# Altium schematic sheet MCU_Unit.SchDoc
size A4
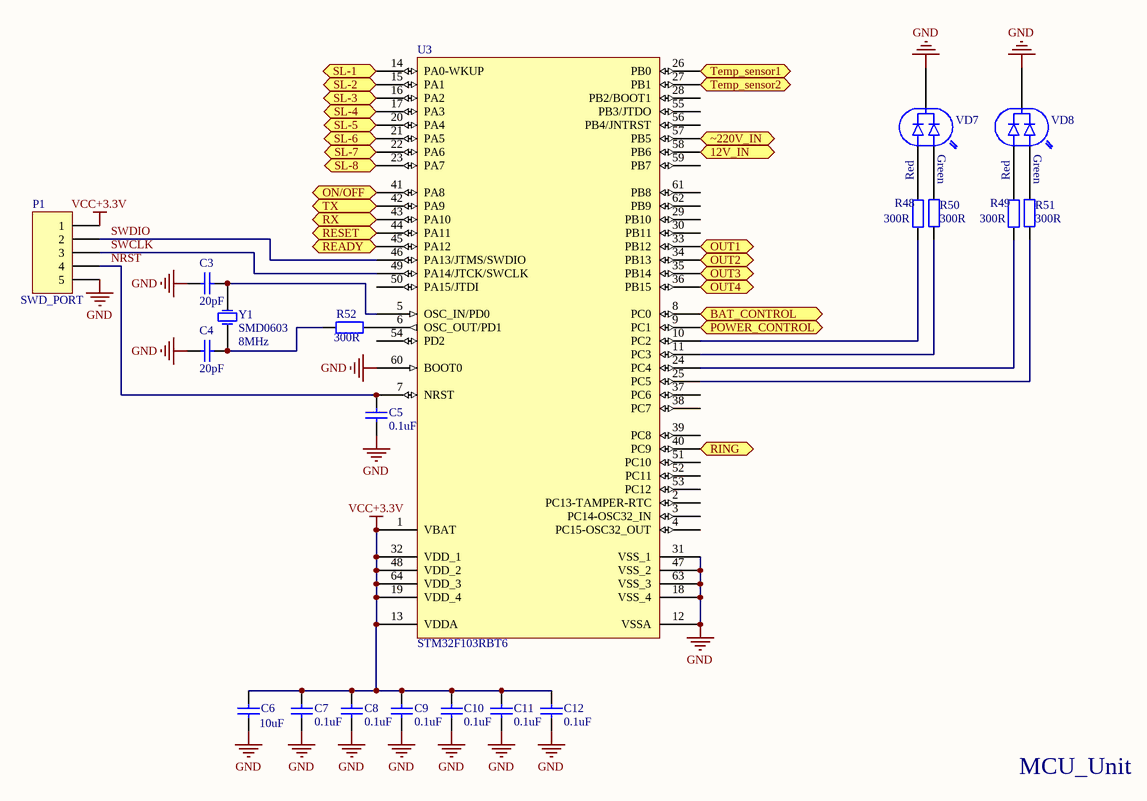
[diagram p0: MCU_Unit.SchDoc]

## Parts
C3  value 20pF  [C0603]  (hidden comment: CAP_SMD)
C4  value 20pF  [C0603]  (hidden comment: CAP_SMD)
C5  value 0.1uF  [C0603]  (hidden comment: CAP_SMD)
C6  value 10uF  [C1210]  (hidden comment: Cap Semi)
C7  value 0.1uF  [C0603]  (hidden comment: CAP_SMD)
C8  value 0.1uF  [C0603]  (hidden comment: CAP_SMD)
C9  value 0.1uF  [C0603]  (hidden comment: CAP_SMD)
C10  value 0.1uF  [C0603]  (hidden comment: CAP_SMD)
C11  value 0.1uF  [C0603]  (hidden comment: CAP_SMD)
C12  value 0.1uF  [C0603]  (hidden comment: CAP_SMD)
P1  SWD_PORT  [HDR1X5]
R48  value 300R  [C0603]  (hidden comment: RES_SMD)
R49  value 300R  [C0603]  (hidden comment: RES_SMD)
R50  value 300R  [C0603]  (hidden comment: RES_SMD)
R51  value 300R  [C0603]  (hidden comment: RES_SMD)
R52  value 300R  [C0603]  (hidden comment: RES_SMD)
U3  STM32F103RBT6  [LQFP64_N]
VD7  LIGHTDIODE2  [LIGHTDIODE2]  (value not drawn)
VD8  LIGHTDIODE2  [LIGHTDIODE2]  (value not drawn)
Y1  SMD0603  [Quartz_SMD0603]

## Ports
12V_IN (in), BAT_CONTROL (in), ON/OFF (out), OUT1 (out), OUT2 (out), OUT3 (out), OUT4 (out), POWER_CONTROL (in), READY (in), RESET (out), RING (in), RX (in), SL-1 (in), SL-2 (in), SL-3 (in), SL-4 (in), SL-5 (in), SL-6 (in), SL-7 (in), SL-8 (in), Temp_sensor1 (in), Temp_sensor2 (in), TX (out), ~220V_IN (in)

## Nets
GND: C3.1 C4.1 C5.2 C6.1 C7.2 C8.2 C9.2 C10.2 C11.2 C12.2 P1.5 U3.12(VSSA) U3.18(VSS_4) U3.31(VSS_1) U3.47(VSS_2) U3.60(BOOT0) U3.63(VSS_3) VD7.1 VD8.1
VCC+3.3V: C6.2 C7.1 C8.1 C9.1 C10.1 C11.1 C12.1 P1.1 U3.1(VBAT) U3.13(VDDA) U3.19(VDD_4) U3.32(VDD_1) U3.48(VDD_2) U3.64(VDD_3)
12V_IN: U3.58(PB6) ; port 12V_IN
BAT_CONTROL: U3.8(PC0) ; port BAT_CONTROL
NRST: C5.1 P1.4 U3.7(NRST)
ON/OFF: U3.41(PA8) ; port ON/OFF
OUT1: U3.33(PB12) ; port OUT1
OUT2: U3.34(PB13) ; port OUT2
OUT3: U3.35(PB14) ; port OUT3
OUT4: U3.36(PB15) ; port OUT4
POWER_CONTROL: U3.9(PC1) ; port POWER_CONTROL
READY: U3.45(PA12) ; port READY
RESET: U3.44(PA11) ; port RESET
RING: U3.40(PC9) ; port RING
RX: U3.43(PA10) ; port RX
SL-1: U3.14(PA0-WKUP) ; port SL-1
SL-2: U3.15(PA1) ; port SL-2
SL-3: U3.16(PA2) ; port SL-3
SL-4: U3.17(PA3) ; port SL-4
SL-5: U3.20(PA4) ; port SL-5
SL-6: U3.21(PA5) ; port SL-6
SL-7: U3.22(PA6) ; port SL-7
SL-8: U3.23(PA7) ; port SL-8
SWCLK: P1.3 U3.49(PA14/JTCK/SWCLK)
SWDIO: P1.2 U3.46(PA13/JTMS/SWDIO)
Temp_sensor1: U3.26(PB0) ; port Temp_sensor1
Temp_sensor2: U3.27(PB1) ; port Temp_sensor2
TX: U3.42(PA9) ; port TX
~220V_IN: U3.57(PB5) ; port ~220V_IN
NetC3_2: C3.2 U3.5(OSC_IN/PD0) Y1.3(OSC2)
NetC4_2: C4.2 R52.1 Y1.1(OSC1)
NetR48_1: R48.1 U3.10(PC2)
NetR48_2: R48.2 VD7.3
NetR49_1: R49.1 U3.24(PC4)
NetR49_2: R49.2 VD8.3
NetR50_1: R50.1 U3.11(PC3)
NetR50_2: R50.2 VD7.2
NetR51_1: R51.1 U3.25(PC5)
NetR51_2: R51.2 VD8.2
NetR52_2: R52.2 U3.6(OSC_OUT/PD1)

Not connected (* = marked no-connect by the designer): U3 2(PC13-TAMPER-RTC) 3(PC14-OSC32_IN) 4(PC15-OSC32_OUT) 28(PB2/BOOT1) 29(PB10) 30(PB11) 37(PC6) 38(PC7) 39(PC8) 50(PA15/JTDI) 51(PC10) 52(PC11) 53(PC12) 54(PD2) 55(PB3/JTDO) 56(PB4/JNTRST) 59(PB7) 61(PB8) 62(PB9)

## Notes on the sheet
- Green
- Red
- MCU_Unit
- (in symbol Quartz_SMD) 8MHz

## Library data of the parts
C3-C5 C7-C12 = Capasitor_SMD_0805: Capasitor_SMD_0808/
C6 = Cap Semi: Capacitor (Semiconductor SIM Model); Published: 8-Jun-2000; LatestRevisionDate: 29-May-2009; LatestRevisionNote: IPC-7351 Footprint Added.; PackageReference: C1206; Publisher: Altium Limited; PackageDescription: Chip Capacitor
P1 = Header 5: Header, 5-Pin; LatestRevisionDate: 17-Jul-2002; LatestRevisionNote: Re-released for DXP Platform.; Publisher: Altium Limited
R48-R52 = RES: Resistor
U3 = STM32F103RBT6: STM32 ARM-based 32-bit MCU with 128 Kbytes Flash, 64-pin LQFP, Industrial Temperature; Published: 30-May-2008; DatasheetVersion: rev6, Mar-2008; PackageVersion: Mar-2008; PackageReference: LQFP64; Publisher: Altium Limited; PackageDescription: 64-Pin Low-Profile Quad Flat Pack, 10 x 10 mm Body, 0.5 mm Pitch (LQFP64); ComponentLink1Description: Manufacturer Link; ComponentLink1URL: www.st.com/stm32; ComponentLink2Description: Datasheet; ComponentLink2URL: http://www.st.com/stonline/products/literature/ds/13587.pdf
Y1 = Quartz_SMD
VD7 VD8 = LIGHTDIODE2: Value: *